# EasyEDA Pro project ProPrj_电容计量V2_2026-06-24.epro, schematic Schematic15_5
Board Name: Board1; Create Date: 2026-01-06; Page Name: P1; Project Name: 电容计量1; Schematic Name: Schematic5; Update Date: 2026-01-06; Page Size: A4; Version: V1.0
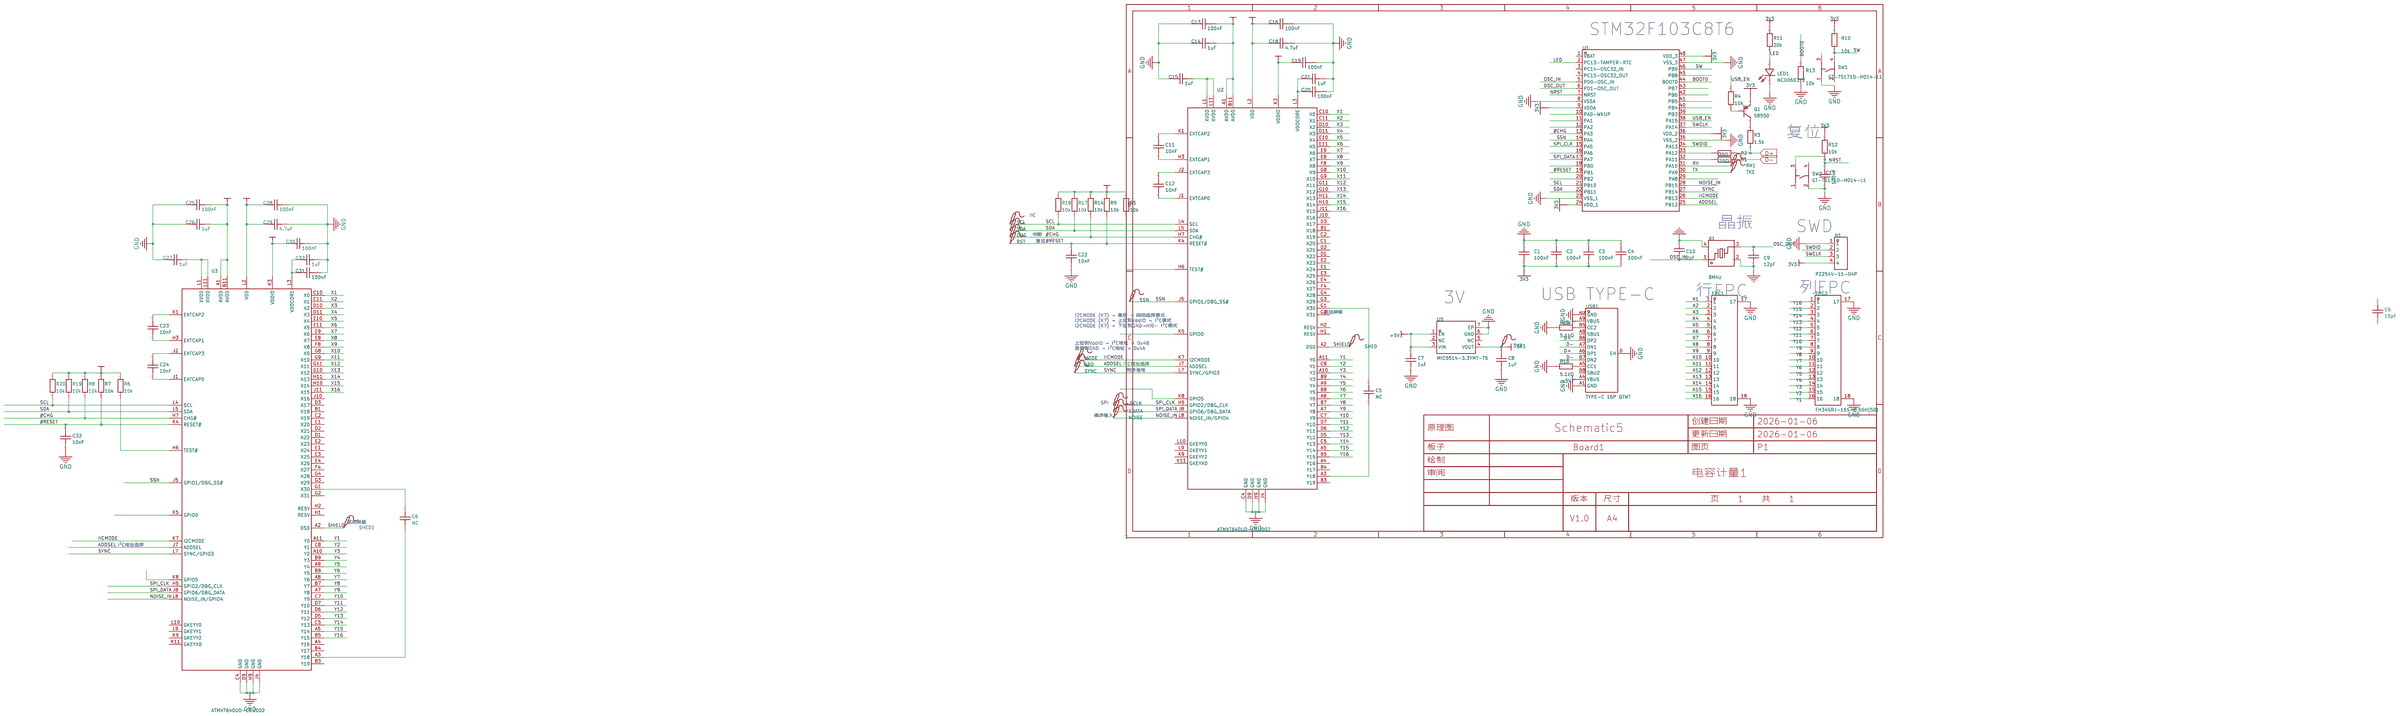
[diagram p0: schematic sheet]

## Parts
3V3  -  [Test-Point-0.5mm]
ADD  -  [Test-Point-0.5mm]
C1  100nF  [C0402]
C2  100nF  [C0402]
C3  100nF  [C0402]
C4  100nF  [C0402]
C5  NC  [C0402]
C6  10pF  [C0402]
C6#2  NC  [C0402]
C7  1uF  [C0402]
C8  1uF  [C0402]
C9  12pF  [C0402]
C10  12pF  [C0402]
C11  10nF  [C0402]
C12  10nF  [C0402]
C13  100nF  [C0402]
C14  1uF  [C0402]
C15  1uF  [C0402]
C16  100nF  [C0402]
C17  100nF  [C0402]
C18  4.7uF  [C0402]
C19  100nF  [C0402]
C20  100nF  [C0402]
C21  1uF  [C0402]
C22  10nF  [C0402]
C23  10nF  [C0402]
C24  10nF  [C0402]
C25  100nF  [C0402]
C26  1uF  [C0402]
C27  1uF  [C0402]
C28  100nF  [C0402]
C29  4.7uF  [C0402]
C30  100nF  [C0402]
C31  100nF  [C0402]
C32  1uF  [C0402]
C33  10nF  [C0402]
CHG  -  [Test-Point-0.5mm]
FPC1  FH34SRJ-16S-0.5SH(50)  [FFC-SMD_16P-P0.50_FH34SRJ-16S-0.5SH]
FPC2  FH34SRJ-16S-0.5SH(50)  [FFC-SMD_16P-P0.50_FH34SRJ-16S-0.5SH]
H1  PZ254V-11-04P  [HDR-TH_4P-P2.54-V-M]
LED1  NCD0603Y2  [LED0603-RD]
MODE  -  [Test-Point-0.5mm]
NOISE  -  [Test-Point-0.5mm]
Q1  S8550  [SOT-23-3_L2.9-W1.3-P1.90-LS2.4-BR]
R1  20Ω  [R0402]
R2  20Ω  [R0402]
R3  1.5k  [R0402]
R4  10k  [R0402]
R5  10k  [R0402]
R6  10k  [R0402]
R7  10k  [R0402]
R8  10k  [R0402]
R9  10k  [R0402]
R10  10k  [R0402]
R11  20k  [R0402]
R12  10k  [R0402]
R13  10k  [R0402]
R14  10k  [R0402]
R15  5.1kΩ  [R0402]
R16  5.1kΩ  [R0402]
R17  10k  [R0402]
R18  10k  [R0402]
R19  10k  [R0402]
R20  10k  [R0402]
RST  -  [Test-Point-0.5mm]
RX1  -  [Test-Point-0.5mm]
SCL  -  [Test-Point-0.5mm]
SCLK  -  [Test-Point-0.5mm]
SDA  -  [Test-Point-0.5mm]
SDATA  -  [Test-Point-0.5mm]
SHED  -  [Test-Point-0.5mm]
SHED1  -  [Test-Point-0.5mm]
SSN  -  [Test-Point-0.5mm]
SW1  GT-TS171D-H014-L1  [SW-SMD_4P-L3.0-W2.8-P1.65-TL_GT-TS171A-H014-L1]
SW2  GT-TS171D-H014-L1  [SW-SMD_4P-L3.0-W2.8-P1.65-TL_GT-TS171A-H014-L1]
SYNC  -  [Test-Point-0.5mm]
TX1  -  [Test-Point-0.5mm]
U1  -  [LQFP-48_L7.0-W7.0-P0.50-LS9.0-BL]
U2  ATMXT640UD-CCU002  [UFBGA-88_L6.0-W6.0-P0.50-TL_MICROCHIP_ATMXT640UXXX]
U3  ATMXT640UD-CCU002  [UFBGA-88_L6.0-W6.0-P0.50-TL_MICROCHIP_ATMXT640UXXX]
U5  MIC5514-3.3YMT-T5  [DFN-6_L1.6-W1.6-P0.50-BL-EP]
USB1  TYPE-C 16P QTWT  [USB-TYPE-C-SMD_TYPE-C-16P-QTWT]
X1  8MHz  [CRYSTAL-SMD_4P-L3.2-W2.5-BL-1]

## Library data of the parts
3V3 ADD CHG MODE NOISE RST RX1 SCL SCLK SDA SDATA SHED SHED1 SSN SYNC TX1 = Test-Point: Test Point 测试点
C1-C6 C6#2 C7 C8 C11-C16 C18-C33 = CC0402KRX7R7BB104: 容值:100nF;精度:±10%;额定电压:16V;温度系数:X7R;; LCSC Part Name: 100nF ±10% 16V; Supplier Part: C60474; Manufacturer: YAGEO(国巨); Supplier Footprint: 0402; JLCPCB Part Class: Extended Part; Datasheet: https://atta.szlcsc.com/upload/public/pdf/source/20211223/9278FD768280B81DDBEF48FA36411A03.pdf; Supplier: LCSC; Tolerance: ±10%; Voltage Rated: 16V; Temperature Coefficient: X7R
C9 C10 = GCM1555C1H120FA16D: 容值:12pF;精度:±1%;额定电压:50V;材质(温度系数):C0G;; LCSC Part Name: 12pF ±1% 50V; Supplier Part: C393682; Manufacturer: muRata(村田); Supplier Footprint: 0402; JLCPCB Part Class: Extended Part; Datasheet: https://atta.szlcsc.com/upload/public/pdf/source/20190516/C393682_2405B7553F1D74F0F214F12B2CF6E34B.pdf; Supplier: LCSC; Tolerance: ±1%; Voltage Rated: 50V; Temperature Coefficient: C0G
C17 = CC0603KRX7R9BB104: 容值:100nF;精度:±10%;额定电压:50V;材质(温度系数):X7R;; LCSC Part Name: 100nF ±10% 50V; Supplier Part: C14663; Manufacturer: YAGEO(国巨); Supplier Footprint: 0603; JLCPCB Part Class: Basic Part; Datasheet: https://atta.szlcsc.com/upload/public/pdf/source/20170116/1484561234239.pdf; Supplier: LCSC; Tolerance: ±10%; Voltage Rated: 50V; Temperature Coefficient: X7R
FPC1 FPC2 = FH34SRJ-16S-0.5SH(50): 锁定特性:-;触点类型:双侧触点/上下接;触点数量:16P;间距:0.5mm;安装方式:卧贴;工作温度:-55℃~+105℃;; LCSC Part Name: 间距:0.5mm P数:16P 双侧触点/上下接; Supplier Part: C324725; Manufacturer: HRS(广濑); Supplier Footprint: SMD,P=0.5mm,卧贴; JLCPCB Part Class: 扩展库; Datasheet: https://item.szlcsc.com/datasheet/FH34SRJ-16S-0.5SH(50)/305535.html; Supplier: LCSC; Contact Type: 双侧触点/上下接; Number of Contacts: 16P; Pitch: 0.5mm; Mounting Type: 卧贴; FFC, FCB Thickness: 0.3mm; Height Above Board: 1mm; Contact Material: 磷青铜; Contact Plating: 金; Operating Temperature: -55℃~+105℃
H1 = PZ254V-11-04P: 插针结构:1x4P;间距:2.54mm;行距:-;圆针/方针:方针;安装方式:直插;排数:单排;总PIN位数:4P;额定电流:3A;额定电压:250V;配合针长度:6mm;塑高:2.5mm;端接针长度:3mm;触头材质:-;工作温度:-40℃~+105℃;颜色:黑色;; LCSC Part Name: 1x4P 间距:2.54mm 方针 直插; Supplier Part: C2691448; Manufacturer: XFCN(兴飞); Supplier Footprint: 插件,P=2.54mm; JLCPCB Part Class: 扩展库; Datasheet: https://item.szlcsc.com/datasheet/PZ254V-11-04P/2801085.html; Supplier: LCSC; Pin Structure: 1x4P; Pitch: 2.54mm; Circluar Pins/Square Pins: 方针; Mounting Type: 直插; Number of Rows: 单排; Number of Pins: 4P; Current Rating: 3A; Voltage Rating (Max): 250V; Length of Mating Pin: 6mm; Insulation Height: 2.5mm; Length of End Connection Pin: 3mm; Operating Temperature: -40℃~+105℃; Color: 黑色
LED1 = NCD0603Y2: 发光颜色:黄色;正向电压(VF):1.6V~2.6V;功率:65mW;正向电流:20mA;主波长:586nm~595nm;透镜颜色:无色透明透镜;发光强度:100mcd~220mcd;发光角度:130°;工作温度:-30℃~+85℃;; Supplier Part: C89811; Manufacturer: 国星光电; Supplier Footprint: 0603; JLCPCB Part Class: Extended Part; Datasheet: https://atta.szlcsc.com/upload/public/pdf/source/20200820/C89811_7FE84B429B6BCA3E113B125EE1452576.pdf; Supplier: LCSC; Emitted Color: 黄色; Forward Voltage (VF): 1.6V~2.6V; Power Dissipation: 65mW; Forward Current: 20mA; Dominant Wavelength: 586nm~595nm; Lens Color: 无色透明透镜; Luminous Intensity: 100mcd~220mcd; Viewing Angle: 130°; Operating Temperature: -30℃~+85℃
Q1 = S8550: LCSC Part Name: PNP -25V -500mA 120-400 SOT-23; Supplier Part: C2931720; Manufacturer: Doeshare(德芯); Supplier Footprint: SOT-23; JLCPCB Part Class: 扩展库; Datasheet: https://atta.szlcsc.com/upload/public/pdf/source/20220104/15A23F6542E365B9E2BA018BE45092B6.pdf; Supplier: LCSC
R1 R2 = 0402WGJ0102TCE: 电阻类型:厚膜电阻;阻值:1kΩ;精度:±5%;功率:1/16W;温度系数:±100ppm/℃;最大工作电压:50V;工作温度范围:-55℃~+155℃;; LCSC Part Name: 1kΩ ±5%; Supplier Part: C25543; Manufacturer: UNI-ROYAL(厚声); Supplier Footprint: 0402; JLCPCB Part Class: Extended Part; Datasheet: https://atta.szlcsc.com/upload/public/pdf/source/20200306/C422600_1E6D84923E4A46A82E41ADD87F860B5C.pdf; Supplier: LCSC; Type: 厚膜电阻; Tolerance: ±5%; Power(Watts): 1/16W; Temperature Coefficient: ±100ppm/℃; Overload Voltage (Max): 50V; Operating Temperature Range: -55℃~+155℃
R3-R14 R17-R20 = 0603WAF1002T5E: LCSC Part Name: 10KΩ(1002) ±1% 编带; Supplier Part: C25804; Manufacturer: UNI-ROYAL(厚声); Supplier Footprint: 0603; JLCPCB Part Class: Basic Part; Datasheet: https://atta.szlcsc.com/upload/public/pdf/source/20170920/C25804_1505901551523983377.pdf; Supplier: LCSC
R15 R16 = 0805W8F5101T5E: 精度:±1%;温度系数:±100ppm/;阻值:5.1kΩ;功率:1/8W;最大工作电压:150V;工作温度范围:-55~+155;; LCSC Part Name: 5.1kΩ ±1%; Supplier Part: C27834; Manufacturer: UNI-ROYAL(厚声); Supplier Footprint: 0805; JLCPCB Part Class: 基础库; Datasheet: https://atta.szlcsc.com/upload/public/pdf/source/20170920/C27834_1505895234018981184.pdf; Supplier: LCSC; Tolerance: ±1%; Temperature Coefficient: ±100ppm/; Power(Watts): 1/8W; Overload Voltage (Max): 150V; Operating Temperature Range: -55~+155
SW1 SW2 = GT-TS171D-H014-L1: 电路结构:单刀单掷;按钮形状:圆形按钮;作用力:80gf;安装方式:立贴;开关长度:3mm;开关宽度:2.75mm;开关高度:1.4mm;带支架:不带支架;触点电流:50mA;额定电压:12V;带灯:无;工作寿命:10万次;; LCSC Part Name: 3*2.75*1.4mm 立贴 轻触开关; Supplier Part: C2762969; Manufacturer: G-Switch(品赞); Supplier Footprint: SMD; JLCPCB Part Class: Extended Part; Datasheet: https://item.szlcsc.com/datasheet/GT-TS171D-H014-L1/2892001.html; Supplier: LCSC; Circuit: 单刀单掷; Actuator Style: 圆形按钮; Operating Force: 80gf; Mounting Type: 立贴; Length: 3mm; Width: 2.75mm; Switch Height: 1.4mm; with Bracket: 不带支架; Contact Current: 50mA; Voltage Rating: 12V; Actuator/Cap Color: 白色; With Lamp: 无; Termination Style: SMD接片; Life: 10万次; Operating Temperature: -30℃~+85℃
U1 = STM32F103C8T6: 工作电压:2V ~ 3.6V;CPU位数:32-Bit;CPU内核:ARM- Cortex--M3;主频（MAX):72MHz;ROM类型:FLASH;; Supplier Part: C8734; Manufacturer: ST(意法半导体); Supplier Footprint: LQFP-48_7x7x05P; JLCPCB Part Class: Basic Part; Datasheet: https://atta.szlcsc.com/upload/public/pdf/source/20140724/1457707174202.pdf; Supplier: LCSC
U2 U3 = ATMXT640UD-CCU002: Supplier Part: C20290559; Manufacturer: MICROCHIP(美国微芯); Supplier Footprint: UFBGA-88(6x6); JLCPCB Part Class: Extended Part; Datasheet: https://atta.szlcsc.com/upload/public/pdf/source/20240115/46BFA6860BFFF0995C0AE8E46E406903.pdf; Supplier: LCSC
U5 = MIC5514-3.3YMT-T5: Supplier Part: C633175; Manufacturer: MICROCHIP(美国微芯); Supplier Footprint: DFN-6-EP(1.6x1.6); JLCPCB Part Class: Extended Part; Datasheet: https://item.szlcsc.com/datasheet/MIC5514-3.3YMT-T5/662840.html; Supplier: LCSC
USB1 = TYPE-C 16P QTWT: 连接器类型:Type-C;协议标准:USB 3.1;公母:母;安装方式:卧贴;触点数量:16P;端口数量:1;额定电流 - 电源:3A;工作温度:-25℃~+85℃;; LCSC Part Name: Type-C 母 卧贴; Supplier Part: C5187472; Manufacturer: SHOU HAN(首韩); Supplier Footprint: SMD; JLCPCB Part Class: Extended Part; Datasheet: https://item.szlcsc.com/datasheet/TYPE-C%252016P%2520QTWT/5860367.html; Supplier: LCSC; Connector Type: Type-C; Protocol Standard: USB 3.1; Gender: 母; Mounting Type: 卧贴; Number of Contacts: 16P; Number of Ports: 1; Current Rating-Power: 3A; Voltage Rating: 5V; Connect-Disconnect Life: 5千次; Detection color: 黑色; Operating Temperature: -25℃~+85℃
X1 = XL2EL89COI-111YLC-8M: 晶振类型:贴片晶振;频率:8MHz;常温频差:±10ppm;外接负载电容:12pF;频率稳定度(全温):±20ppm;; LCSC Part Name: 8MHz ±10ppm 12pF; Supplier Part: C2973805; Manufacturer: YXC(扬兴晶振); Supplier Footprint: SMD3225-4P; JLCPCB Part Class: 扩展库; Datasheet: https://atta.szlcsc.com/upload/public/pdf/source/20240329/19D5F850207469550BEB00D7DFEDBC7A.pdf; Supplier: LCSC; Crystal Type: 贴片晶振; Normal temperature Frequency Tolerance: ±10ppm; External load capacitor: 12pF; Frequency Stability(Full temperature range): ±20ppm; Equivalent Series Resistance (ESR): 150Ω; Operating Temperature: -40℃~+85℃

## Nets
3V3: 3V3.1 C1.1 C2.1 C3.1 C4.1 C8.2 C13.1 C14.1 C16.2 C18.2 C19.2 C25.1 C26.1 C28.2 C29.2 C30.2 H1.4 Q1.2(E) R5.2 R6.2 R7.2 R8.2 R9.2 R10.2 R11.2 R12.2 R14.2 R17.2 R18.2 R19.2 R20.2 U1.9(VDDA) U1.24(VDD_1) U1.36(VDD_2) U1.48(VDD_3) U2.A1(AVDD) U2.B11(AVDD) U2.K3(VDDIO) U2.L2(VDD) U3.A1(AVDD) U3.B11(AVDD) U3.K3(VDDIO) U3.L2(VDD) U5.4(VOUT)
+5V: C7.2 U5.1(EN) U5.3(VIN) USB1.A4(VBUS) USB1.A9(VBUS)
GND: C1.2 C2.2 C3.2 C4.2 C7.1 C8.1 C9.1 C10.2 C13.2 C14.2 C15.2 C16.1 C17.1 C18.1 C19.1 C20.1 C21.1 C22.1 C25.2 C26.2 C27.2 C28.1 C29.1 C30.1 C31.1 C32.1 C33.1 FPC1.17 FPC1.18 FPC2.17 FPC2.18 H1.1 LED1.1(K) R13.1 R15.2 R16.2 SW1.1 SW2.2 U1.8(VSSA) U1.23(VSS_1) U1.35(VSS_2) U1.47(VSS_3) U2.C4(GND) U2.D9(GND) U2.H9(GND) U2.J4(GND) U3.C4(GND) U3.D9(GND) U3.H9(GND) U3.J4(GND) U5.6(GND) U5.7(EP) USB1.0(EH) USB1.A1(GND) USB1.A12(GND) X1.2(GND) X1.4(GND)
#CHG: CHG.1 R8.1 R14.1 U1.13(PA3) U2.H7(CHG#) U3.H7(CHG#)
#RESET: C22.2 C33.2 R7.1 R9.1 RST.1 U1.19(PB1) U2.K4(RESET#) U3.K4(RESET#)
ADDSEL: ADD.1 U1.25(PB12) U2.J7(ADDSEL) U3.J7(ADDSEL)
BOOT0: R13.2 U1.44(BOOT0)
D+: R2.2 R3.1 USB1.A6(DP1) USB1.B6(DP2)
D-: R1.2 USB1.A7(DN1) USB1.B7(DN2)
IICMODE: MODE.1 U1.26(PB13) U2.K7(I2CMODE) U3.K7(I2CMODE)
LED: LED1.2(A) R11.1 U1.2(PC13-TAMPER-RTC)
NOISE_IN: NOISE.1 U1.28(PB15) U2.L8(NOISE_IN/GPIO4) U3.L8(NOISE_IN/GPIO4)
NRST: C17.2 R12.1 SW2.3 U1.7(NRST)
OSC_IN: C10.1 U1.5(PD0-OSC_IN) X1.1
OSC_OUT: C9.2 U1.6(PD1-OSC_OUT) X1.3
RX: RX1.1 U1.31(PA10)
SCL: R18.1 R20.1 SCL.1 U1.21(PB10) U2.L4(SCL) U3.L4(SCL)
SDA: R17.1 R19.1 SDA.1 U1.22(PB11) U2.L5(SDA) U3.L5(SDA)
SHIELD: SHED.1 SHED1.1 U2.A2(DS0) U3.A2(DS0)
SPI_CLK: SCLK.1 U1.15(PA5) U2.H5(GPIO2/DBG_CLK) U3.H5(GPIO2/DBG_CLK)
SPI_DATA: SDATA.1 U1.17(PA7) U2.J8(GPIO6/DBG_DATA) U3.J8(GPIO6/DBG_DATA)
SSN: SSN.1 U1.14(PA4) U2.J5(GPIO1/DBG_SS#) U3.J5(GPIO1/DBG_SS#)
SW: R10.1 SW1.4 U1.46(PB9)
SWCLK: H1.3 U1.37(PA14)
SWDIO: H1.2 U1.34(PA13)
SYNC: SYNC.1 U1.27(PB14) U2.L7(SYNC/GPIO3) U3.L7(SYNC/GPIO3)
TX: TX1.1 U1.30(PA9)
USB_EN: R4.2 U1.38(PA15)
X1: FPC1.1 U2.C10(X0) U3.C10(X0)
X2: FPC1.2 U2.C11(X1) U3.C11(X1)
X3: FPC1.3 U2.D10(X2) U3.D10(X2)
X4: FPC1.4 U2.D11(X3) U3.D11(X3)
X5: FPC1.5 U2.E10(X4) U3.E10(X4)
X6: FPC1.6 U2.E11(X5) U3.E11(X5)
X7: FPC1.7 U2.E9(X6) U3.E9(X6)
X8: FPC1.8 U2.E8(X7) U3.E8(X7)
X9: FPC1.9 U2.F8(X8) U3.F8(X8)
X10: FPC1.10 U2.G8(X9) U3.G8(X9)
X11: FPC1.11 U2.G9(X10) U3.G9(X10)
X12: FPC1.12 U2.G11(X11) U3.G11(X11)
X13: FPC1.13 U2.G10(X12) U3.G10(X12)
X14: FPC1.14 U2.H11(X13) U3.H11(X13)
X15: FPC1.15 U2.H10(X14) U3.H10(X14)
X16: FPC1.16 U2.J11(X15) U3.J11(X15)
Y1: FPC2.16 U2.A11(Y0) U3.A11(Y0)
Y2: FPC2.15 U2.C8(Y1) U3.C8(Y1)
Y3: FPC2.14 U2.A10(Y2) U3.A10(Y2)
Y4: FPC2.13 U2.B9(Y3) U3.B9(Y3)
Y5: FPC2.12 U2.A9(Y4) U3.A9(Y4)
Y6: FPC2.11 U2.B8(Y5) U3.B8(Y5)
Y7: FPC2.10 U2.A8(Y6) U3.A8(Y6)
Y8: FPC2.9 U2.B7(Y7) U3.B7(Y7)
Y9: FPC2.8 U2.A7(Y8) U3.A7(Y8)
Y10: FPC2.7 U2.C7(Y9) U3.C7(Y9)
Y11: FPC2.6 U2.D7(Y10) U3.D7(Y10)
Y12: FPC2.5 U2.D6(Y11) U3.D6(Y11)
Y13: FPC2.4 U2.D5(Y12) U3.D5(Y12)
Y14: FPC2.3 U2.C5(Y13) U3.C5(Y13)
Y15: FPC2.2 U2.A5(Y14) U3.A5(Y14)
Y16: FPC2.1 U2.B5(Y15) U3.B5(Y15)
$1N12: R16.1 USB1.A5(CC1)
$1N14: R15.1 USB1.B5(CC2)
$1N194: Q1.1(B) R4.1
$1N196: Q1.3(C) R3.2
$1N212: R2.1 U1.33(PA12)
$1N232: R1.1 U1.32(PA11)
$1N275: C12.2 U2.J2(EXTCAP3)
$1N276: C12.1 U2.J1(EXTCAP0)
$1N277: C11.1 U2.H3(EXTCAP1)
$1N278: C11.2 U2.K1(EXTCAP2)
$1N299: R5.1 U2.H6(TEST#)
$1N301: C15.1 U2.L1(XVDD) U2.L11(XVDD)
$1N305: C20.2 C21.2 U2.L3(VDDCORE)
$1N379: C5.1 U2.A3(Y18)
$1N380: C5.2 U2.G1(X30)
Net-(C6#2-1): C6#2.1 U3.A3(Y18)
Net-(C6#2-2): C6#2.2 U3.G1(X30)
Net-(C23-1): C23.1 U3.H3(EXTCAP1)
Net-(C23-2): C23.2 U3.K1(EXTCAP2)
Net-(C24-1): C24.1 U3.J1(EXTCAP0)
Net-(C24-2): C24.2 U3.J2(EXTCAP3)
Net-(C27-1): C27.1 U3.L1(XVDD) U3.L11(XVDD)
Net-(C31-2): C31.2 C32.2 U3.L3(VDDCORE)
Net-(R6-1): R6.1 U3.H6(TEST#)

Not connected (* = marked no-connect by the designer): C6 1 2; SW1 2 3; SW2 1 4; U1 1(VBAT) 3(PC14-OSC32_IN) 4(PC15-OSC32_OUT) 10(PA0-WKUP) 11(PA1) 12(PA2) 16(PA6) 18(PB0) 20(PB2) 29(PA8) 39(PB3) 40(PB4) 41(PB5) 42(PB6) 43(PB7) 45(PB8); U2 A4(Y16) B1(X18) B3(Y19) B4(Y17) C1(X20) C2(X19) D1(X22) D2(X21) D3(X17) E1(X24) E2(X23) E3(X25) E4(X26) F4(X27) G2(X31) G3(X29) G4(X28) H1(RESV) H2(RESV) J10(X16) K5(GPIO0) K8(GPIO5) K9(GKEYY2) K11(GKEYX0) L9(GKEYY1) L10(GKEYY0); U3 A4(Y16) B1(X18) B3(Y19) B4(Y17) C1(X20) C2(X19) D1(X22) D2(X21) D3(X17) E1(X24) E2(X23) E3(X25) E4(X26) F4(X27) G2(X31) G3(X29) G4(X28) H1(RESV) H2(RESV) J10(X16) K5(GPIO0) K8(GPIO5) K9(GKEYY2) K11(GKEYX0) L9(GKEYY1) L10(GKEYY0); U5 2(NC) 5(NC); USB1 A8(SBU1) B8(SBU2)

## Notes on the sheet
- STM32F103C8T6
- 复位
- IIC
- 中断
- 晶振
- SWD
- 复位
- 列FPC
- 3V
- USB TYPE-C
- 行FPC
- I2CMODE (K7) → 悬空 → 自动选择模式
  I2CMODE (K7) → 上拉到VddIO → I²C模式
  I2CMODE (K7) → 下拉到GND→HID- I²C模式
- 驱动屏蔽
- 上拉到VddIO → I²C地址 = 0x4B
  连接到GND → I²C地址 = 0x4A
- I²C地址选择
- 同步信号
- SPI
- 噪声输入
- 驱动屏蔽
- I²C地址选择
